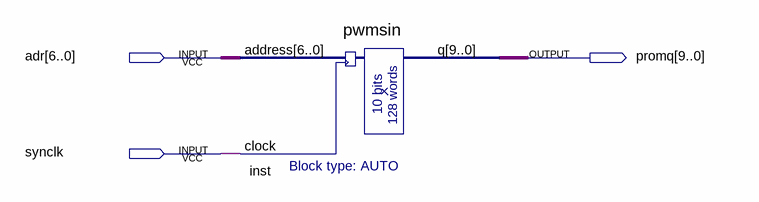
[diagram p0: schematic sheet]
// Quartus schematic pwmsin.bdf as structural Verilog: 1 symbols, 3 pins
module pwmsin (
  input  [6:0] adr,
  input  synclk,
  output [9:0] promq
);

  pwmsin inst (.address(adr), .clock(synclk), .q(promq));
endmodule
